# EAGLE board AM_BE200_x32_Rev1 (EAGLE 6.5.0), part 1 of 3
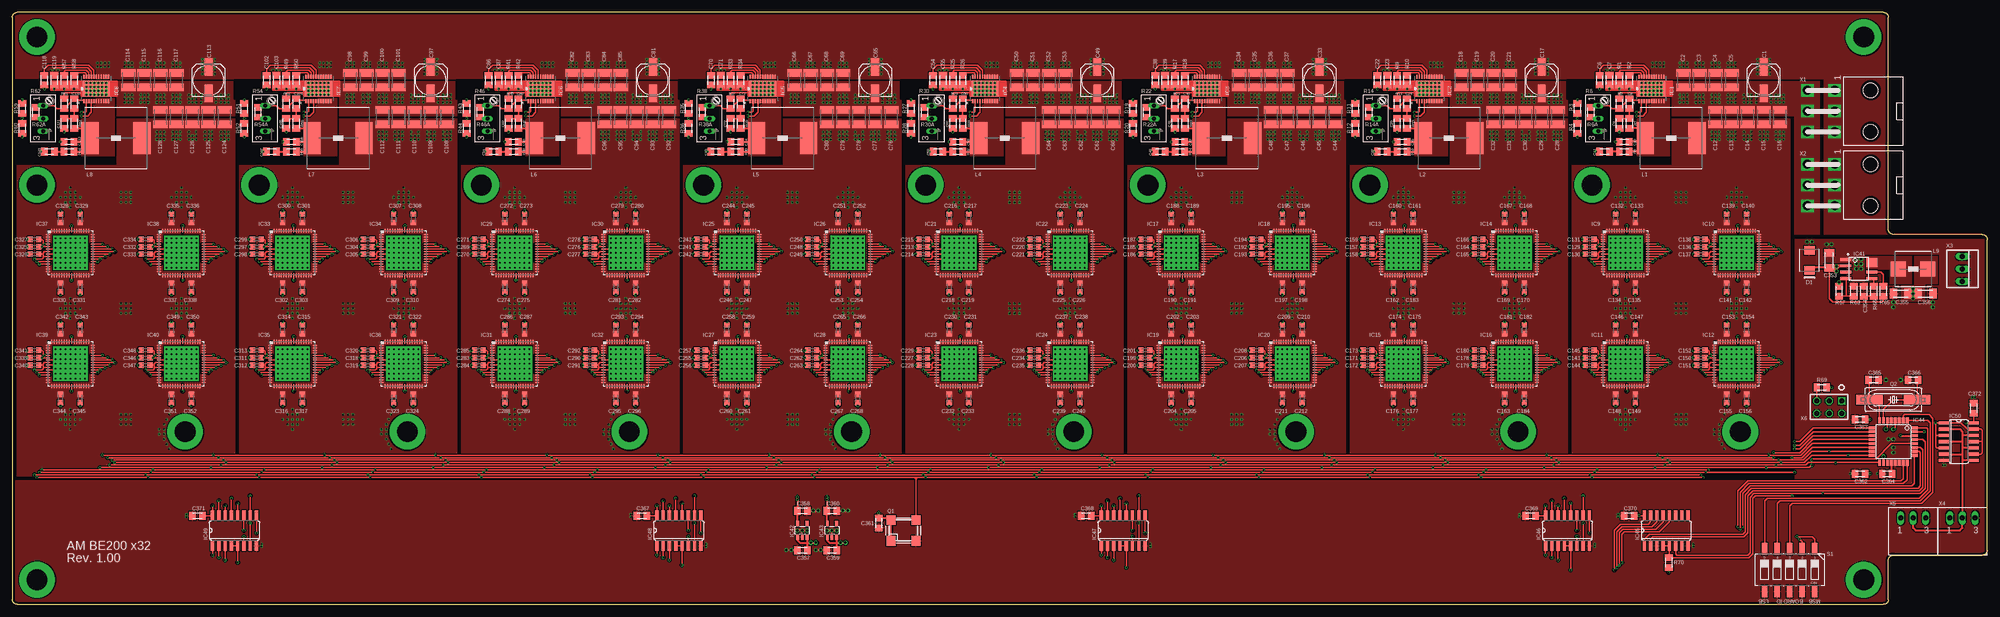
[diagram p9: board, top side]
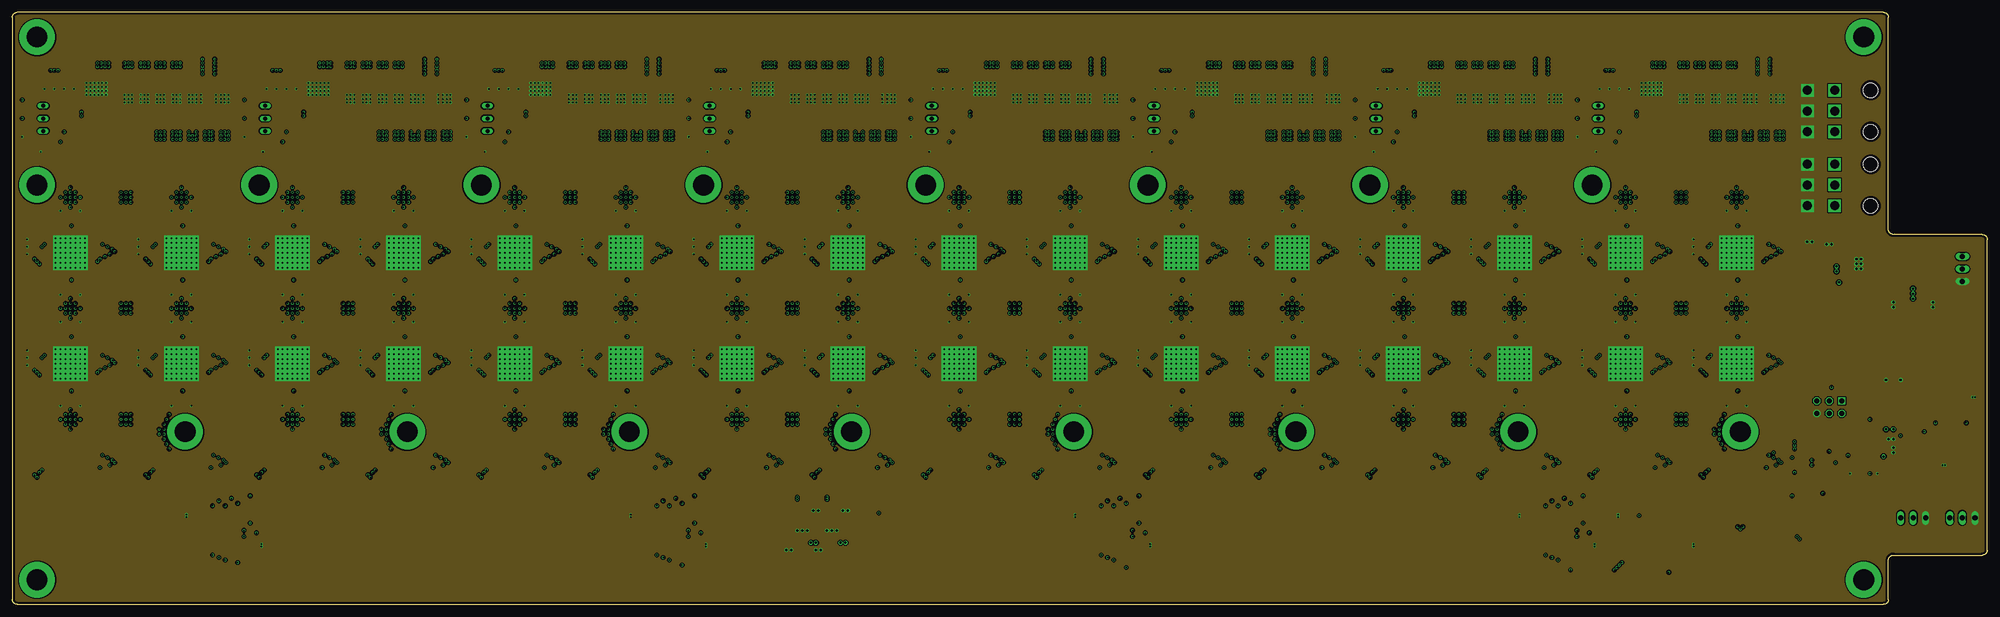
[diagram p10: board, inner layer Route2]
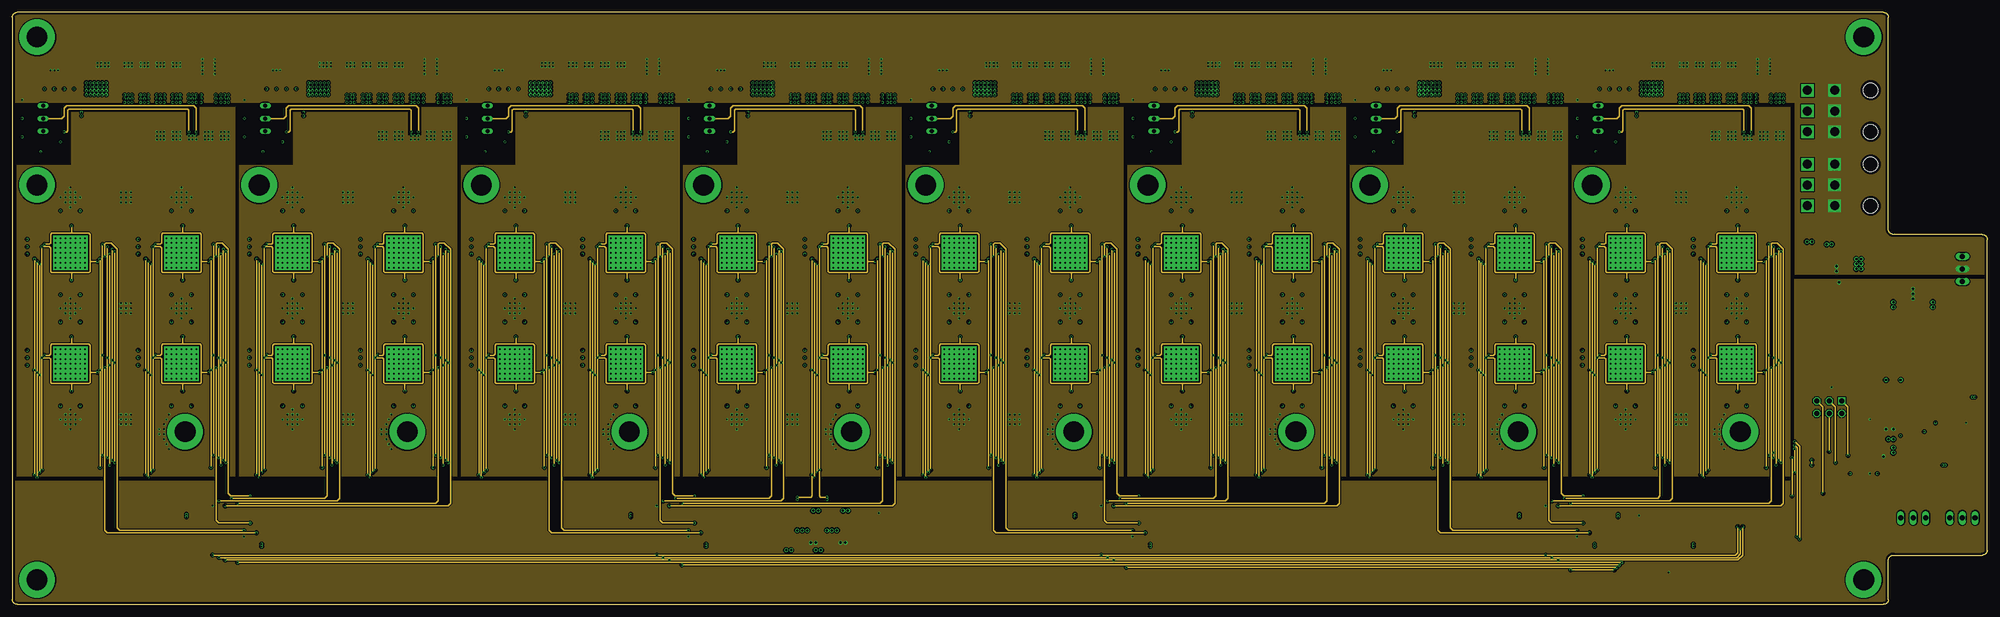
[diagram p11: board, inner layer Route15]
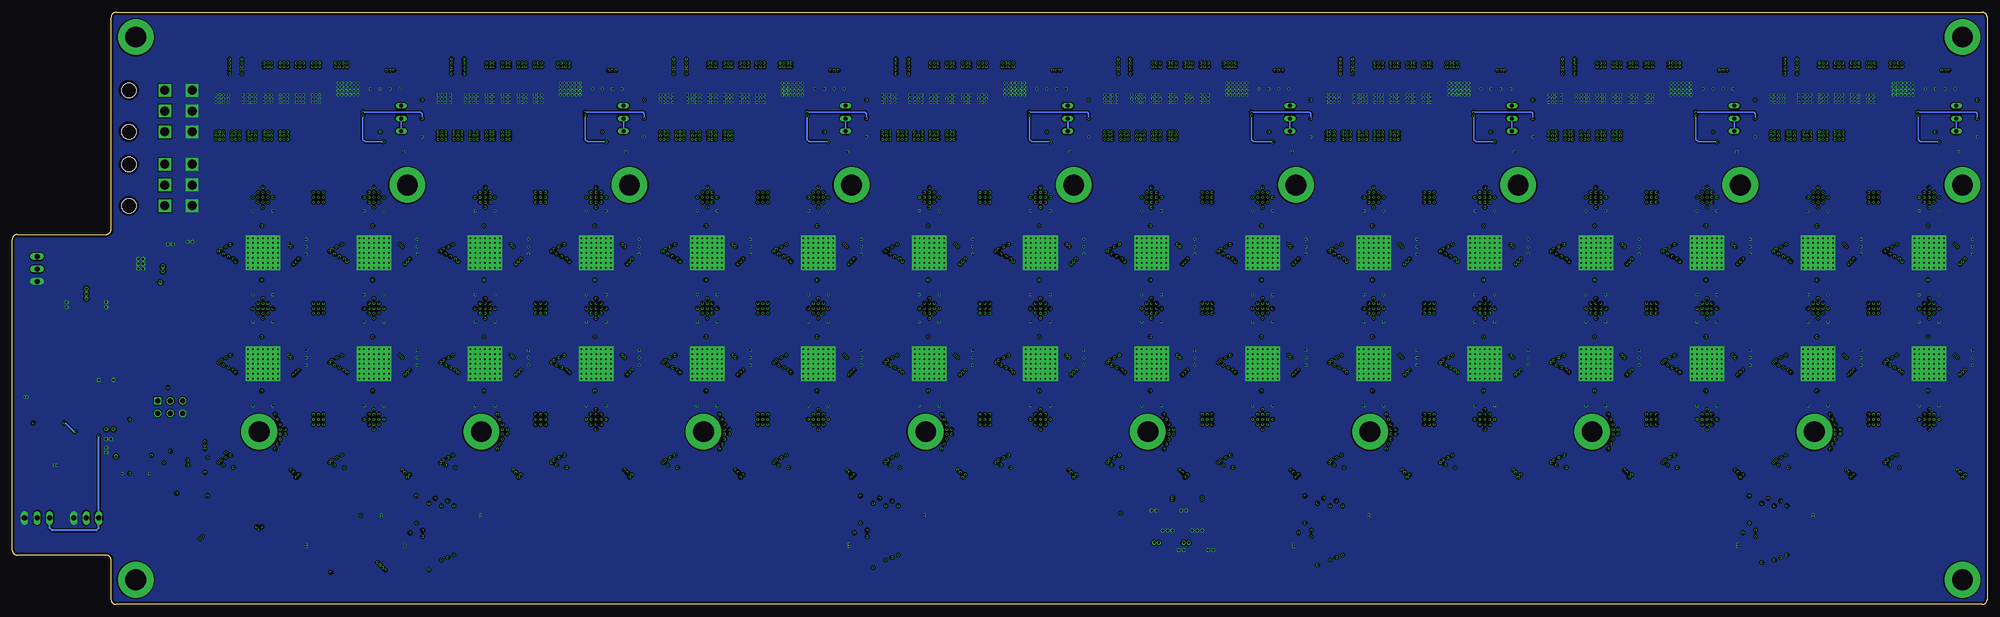
[diagram p12: board, bottom side, seen from below]

Size 400 x 120 mm. Coordinates in mm from the lower left corner, seen from the top.
Outline: 0,119 0,1 arc90 1,0 379,0 arc90 380,1 380,9 arc-90 381,10 399,10 arc90 400,11 400,74 arc90 399,75 381,75 arc-90 380,76 380,119 arc90 379,120 1,120 arc90 0,119
Copper layers (1*2*15*16): Top 0.035mm / dielectric 0.5mm / Route2 0.035mm / dielectric 0.5mm / Route15 0.035mm / dielectric 0.5mm / Bottom 0.035mm
Design rules "default *": minimum track width 8mil, minimum drill 0.3mm, track to track 5mil, track to pad 5mil, pad to pad 5mil, via to via 5mil, smd to smd 4mil, copper to edge 20mil, drill to drill 8mil, minimum pad ring 5mil, minimum via ring 0mil, stop-mask expansion 4mil, vias tented up to drill 30mil, thermal gap 10mil
tRestrict: area 368.2,61.2 to 371.2,68.2; area 0,102.5 to 13.8,106.2; area 45,102.5 to 58.8,106.2; area 90,102.5 to 103.8,106.2; area 135,102.5 to 148.8,106.2; area 180,102.5 to 193.8,106.2; area 225,102.5 to 238.8,106.2; area 270,102.5 to 283.8,106.2; area 315,102.5 to 328.8,106.2

## Footprints (pad centres in the part's own frame; a part is rotated, then mirrored left to right if it is on the bottom)
153CLV-0605 = smd 3.5 x 1.6: + 2.7,0; - -2.7,0
C1210K = smd 1.5 x 2.9: 1 -1.5,0; 2 1.5,0
C0805K = smd 1.3 x 1.6: 1 -1,0; 2 1,0
MYRCL_C0603K = smd 1.05 x 1.08: 1 -0.875,0; 2 0.875,0
C1206K = smd 1.5 x 2: 1 -1.5,0; 2 1.5,0
SMBJ = smd 1.78 x 2.16: A 2.04,0; C -2.03,0
DQP22_5P479X3P24 = smd 0.85 x 0.28: 1 -2.475,2.5; 2 -2.475,2; 3 -2.475,1.5; 4 -2.475,1; 5 -2.475,0.5; 6 -2.475,0; 7 -2.475,-0.5; 8 -2.475,-1; 9 -2.475,-1.5; 10 -2.475,-2; 11 -2.475,-2.5; 12 2.475,-2.5; 13 2.475,-2; 14 2.475,-1.5; 15 2.475,-1; 16 2.475,-0.5; 17 2.475,0; 18 2.475,0.5; 19 2.475,1; 20 2.475,1.5; 21 2.475,2; 22 2.475,2.5 | smd 3.24 x 5.48: 23 0,0 | drill 0.3: GND@1 -1.2,2; GND@2 -0.4,2; GND@3 0.4,2; GND@4 1.2,2; GND@5 -1.2,1.2; GND@6 -0.4,1.2; GND@7 0.4,1.2; GND@8 1.2,1.2; GND@9 -1.2,0.406; GND@10 -0.4,0.4; GND@11 0.4,0.4; GND@12 1.2,0.406; GND@13 -1.2,-0.406; GND@14 -0.4,-0.4; GND@15 0.4,-0.4; GND@16 1.2,-0.406; GND@17 -1.2,-1.2; GND@18 -0.4,-1.2; GND@19 0.4,-1.2; GND@20 1.2,-1.2; GND@21 -1.2,-2; GND@22 -0.4,-2; GND@23 0.4,-2; GND@24 1.2,-2
QFN64-9X9 = smd 0.95 x 0.28: 1 -4.525,3.75; 2 -4.525,3.25; 3 -4.525,2.75; 4 -4.525,2.25; 5 -4.525,1.75; 6 -4.525,1.25; 7 -4.525,0.75; 8 -4.525,0.25; 9 -4.525,-0.25; 10 -4.525,-0.75; 11 -4.525,-1.25; 12 -4.525,-1.75; 13 -4.525,-2.25; 14 -4.525,-2.75; 15 -4.525,-3.25; 16 -4.525,-3.75; 33 4.525,-3.75; 34 4.525,-3.25; 35 4.525,-2.75; 36 4.525,-2.25; 37 4.525,-1.75; 38 4.525,-1.25; 39 4.525,-0.75; 40 4.525,-0.25; 41 4.525,0.25; 42 4.525,0.75; 43 4.525,1.25; 44 4.525,1.75; 45 4.525,2.25; 46 4.525,2.75; 47 4.525,3.25; 48 4.525,3.75 | smd 0.28 x 0.95: 17 -3.75,-4.525; 18 -3.25,-4.525; 19 -2.75,-4.525; 20 -2.25,-4.525; 21 -1.75,-4.525; 22 -1.25,-4.525; 23 -0.75,-4.525; 24 -0.25,-4.525; 25 0.25,-4.525; 26 0.75,-4.525; 27 1.25,-4.525; 28 1.75,-4.525; 29 2.25,-4.525; 30 2.75,-4.525; 31 3.25,-4.525; 32 3.75,-4.525; 49 3.75,4.525; 50 3.25,4.525; 51 2.75,4.525; 52 2.25,4.525; 53 1.75,4.525; 54 1.25,4.525; 55 0.75,4.525; 56 0.25,4.525; 57 -0.25,4.525; 58 -0.75,4.525; 59 -1.25,4.525; 60 -1.75,4.525; 61 -2.25,4.525; 62 -2.75,4.525; 63 -3.25,4.525; 64 -3.75,4.525 | drill 0.3 pad 1 square: EXP@1 -3,3; EXP@2 -2,3; EXP@3 -1,3; EXP@4 0,3; EXP@5 1,3; EXP@6 2,3; EXP@7 3,3; EXP@8 -3,2; EXP@9 -2,2; EXP@10 -1,2; EXP@11 0,2; EXP@12 1,2; EXP@13 2,2; EXP@14 3,2; EXP@15 -3,1; EXP@16 -2,1; EXP@17 -1,1; EXP@18 0,1; EXP@19 1,1; EXP@20 2,1; EXP@21 3,1; EXP@22 -3,0; EXP@23 -2,0; EXP@24 -1,0; EXP@25 0,0; EXP@26 1,0; EXP@27 2,0; EXP@28 3,0; EXP@29 -3,-1; EXP@30 -2,-1; EXP@31 -1,-1; EXP@32 0,-1; EXP@33 1,-1; EXP@34 2,-1; EXP@35 3,-1; EXP@36 -3,-2; EXP@37 -2,-2; EXP@38 -1,-2; EXP@39 0,-2; EXP@40 1,-2; EXP@41 2,-2; EXP@42 3,-2; EXP@43 -3,-3; EXP@44 -2,-3; EXP@45 -1,-3; EXP@46 0,-3; EXP@47 1,-3; EXP@48 2,-3; EXP@49 3,-3
AOZ1021 = smd 0.6 x 2.2: AGND 0.635,-2.6; COMP 1.905,2.6; EN 0.635,2.6; FB 1.905,-2.6; PGND -1.905,-2.6; VIN -0.635,-2.6 | smd 1.87 x 2.2: LX -1.27,2.6
SOT-23-5 = smd 0.55 x 1.2: 1 -0.95,-1.3; 2 0,-1.3; 3 0.95,-1.3; 4 0.95,1.3; 5 -0.95,1.3
TQFP32-08 = smd 1.27 x 0.559: 1 -4.293,2.8; 2 -4.293,2; 3 -4.293,1.2; 4 -4.293,0.4; 5 -4.293,-0.4; 6 -4.293,-1.2; 7 -4.293,-2; 8 -4.293,-2.8; 17 4.293,-2.8; 18 4.293,-2; 19 4.293,-1.2; 20 4.293,-0.4; 21 4.293,0.4; 22 4.293,1.2; 23 4.293,2; 24 4.293,2.8 | smd 0.559 x 1.27: 9 -2.8,-4.293; 10 -2,-4.293; 11 -1.2,-4.293; 12 -0.4,-4.293; 13 0.4,-4.293; 14 1.2,-4.293; 15 2,-4.293; 16 2.8,-4.293; 25 2.8,4.293; 26 2,4.293; 27 1.2,4.293; 28 0.4,4.293; 29 -0.4,4.293; 30 -1.2,4.293; 31 -2,4.293; 32 -2.8,4.293
SO16 = smd 0.66 x 2.032: 1 -4.445,-3.073; 2 -3.175,-3.073; 3 -1.905,-3.073; 4 -0.635,-3.073; 5 0.635,-3.073; 6 1.905,-3.073; 7 3.175,-3.073; 8 4.445,-3.073; 9 4.445,3.073; 10 3.175,3.073; 11 1.905,3.073; 12 0.635,3.073; 13 -0.635,3.073; 14 -1.905,3.073; 15 -3.175,3.073; 16 -4.445,3.073
SO14 = smd 0.66 x 2.032: 1 -3.81,-3.073; 2 -2.54,-3.073; 3 -1.27,-3.073; 4 0,-3.073; 5 1.27,-3.073; 6 2.54,-3.073; 7 3.81,-3.073; 8 3.81,3.073; 9 2.54,3.073; 10 1.27,3.073; 11 0,3.073; 12 -1.27,3.073; 13 -2.54,3.073; 14 -3.81,3.073
INDUCTOR_PA0513 = smd 3.5 x 6.5: 1 -5.25,0; 2 5.25,0
INDCUCTOR_7.3X7.3 = smd 3 x 3: 1 -3,0; 2 3,0
OSCILLATOR_7X5_SMD = smd 1.8 x 2: 1 -2.54,-2.1; 2 2.54,-2.1; 3 2.54,2.1; 4 -2.54,2.1
HC49UP = smd 5.334 x 1.93: 1 -4.826,0; 2 4.826,0
R0805K = smd 1.3 x 1.6: 1 -1,0; 2 1,0
S64W = drill 0.813 long: A 2.54,1.27; E -2.54,1.27; S 0,1.27
CTS-219-05 = smd 1.13 x 2.44: 1 -5.08,-4.3; 2 -2.54,-4.3; 3 0,-4.3; 4 2.54,-4.3; 5 5.08,-4.3; 6 5.08,4.3; 7 2.54,4.3; 8 0,4.3; 9 -2.54,4.3; 10 -5.08,4.3
PCIE6_4.2 = drill 1.8 square: P1 4.2,-2.1; P2 0,-2.1; P3 -4.2,-2.1; P4 4.2,3.4; P5 0,3.4; P6 -4.2,3.4 | hole 3: -4.2,-9.4; 4.2,-9.4
22-23-2031 = drill 1 long: 1 -2.54,0; 2 0,0; 3 2.54,0
XH2.54-3P = drill 1.016 long: 1 -2.54,2.54; 2 0,2.54; 3 2.54,2.54
AVR-ISP-6 = drill 1.016 square: 1 -2.54,-1.27 | drill 1.016 octagon: 2 -2.54,1.27; 3 0,-1.27; 4 0,1.27; 5 2.54,-1.27; 6 2.54,1.27

## Placement (x,y rotation side)
C1  100uF  [153CLV-0605]  354.75,106.25 90 top
C2  22uF  [C1210K]  338.5,106.25 270 top
C3  22uF  [C1210K]  341.75,106.25 270 top
C4  22uF  [C1210K]  345,106.25 270 top
C5  22uF  [C1210K]  348.25,106.25 270 top
C6  4.7uF  [C0805K]  321.5,106.25 270 top
C7  4.7uF  [C0805K]  323.5,106.25 270 top
C8  1nF  [C0805K]  327.5,101.5 90 top
C9  22nF  [C0805K]  325.5,97.5 90 top
C10  100nF  [C0805K]  326.5,93.75 0 top
C11  2,2nF  [C0805K]  322.5,91.75 180 top
C12  100uF  [C1210K]  345,98.75 90 top
C13  100uF  [C1210K]  348.25,98.75 90 top
C14  100uF  [C1210K]  351.5,98.75 90 top
C15  100uF  [C1210K]  354.75,98.75 90 top
C16  100uF  [C1210K]  358,98.75 90 top
C17  100uF  [153CLV-0605]  309.75,106.25 90 top
C18  22uF  [C1210K]  293.5,106.25 270 top
C19  22uF  [C1210K]  296.75,106.25 270 top
C20  22uF  [C1210K]  300,106.25 270 top
C21  22uF  [C1210K]  303.25,106.25 270 top
C22  4.7uF  [C0805K]  276.5,106.25 270 top
C23  4.7uF  [C0805K]  278.5,106.25 270 top
C24  1nF  [C0805K]  282.5,101.5 90 top
C25  22nF  [C0805K]  280.5,97.5 90 top
C26  100nF  [C0805K]  281.5,93.75 0 top
C27  2,2nF  [C0805K]  277.5,91.75 180 top
C28  100uF  [C1210K]  313,98.75 90 top
C29  100uF  [C1210K]  309.75,98.75 90 top
C30  100uF  [C1210K]  306.5,98.75 90 top
C31  100uF  [C1210K]  303.25,98.75 90 top
C32  100uF  [C1210K]  300,98.75 90 top
C33  100uF  [153CLV-0605]  264.75,106.25 90 top
C34  22uF  [C1210K]  248.5,106.25 270 top
C35  22uF  [C1210K]  251.75,106.25 270 top
C36  22uF  [C1210K]  255,106.25 270 top
C37  22uF  [C1210K]  258.25,106.25 270 top
C38  4.7uF  [C0805K]  231.5,106.25 270 top
C39  4.7uF  [C0805K]  233.5,106.25 270 top
C40  1nF  [C0805K]  237.5,101.5 90 top
C41  22nF  [C0805K]  235.5,97.5 90 top
C42  100nF  [C0805K]  236.5,93.75 0 top
C43  2,2nF  [C0805K]  232.5,91.75 180 top
C44  100uF  [C1210K]  268,98.75 90 top
C45  100uF  [C1210K]  264.75,98.75 90 top
C46  100uF  [C1210K]  261.5,98.75 90 top
C47  100uF  [C1210K]  258.25,98.75 90 top
C48  100uF  [C1210K]  255,98.75 90 top
C49  100uF  [153CLV-0605]  219.75,106.25 90 top
C50  22uF  [C1210K]  203.5,106.25 270 top
C51  22uF  [C1210K]  206.75,106.25 270 top
C52  22uF  [C1210K]  210,106.25 270 top
C53  22uF  [C1210K]  213.25,106.25 270 top
C54  4.7uF  [C0805K]  186.5,106.25 270 top
C55  4.7uF  [C0805K]  188.5,106.25 270 top
C56  1nF  [C0805K]  192.5,101.5 90 top
C57  22nF  [C0805K]  190.5,97.5 90 top
C58  100nF  [C0805K]  191.5,93.75 0 top
C59  2,2nF  [C0805K]  187.5,91.75 180 top
C60  100uF  [C1210K]  223,98.75 90 top
C61  100uF  [C1210K]  219.75,98.75 90 top
C62  100uF  [C1210K]  216.5,98.75 90 top
C63  100uF  [C1210K]  213.25,98.75 90 top
C64  100uF  [C1210K]  210,98.75 90 top
C65  100uF  [153CLV-0605]  174.75,106.25 90 top
C66  22uF  [C1210K]  158.5,106.25 270 top
C67  22uF  [C1210K]  161.75,106.25 270 top
C68  22uF  [C1210K]  165,106.25 270 top
C69  22uF  [C1210K]  168.25,106.25 270 top
C70  4.7uF  [C0805K]  141.5,106.25 270 top
C71  4.7uF  [C0805K]  143.5,106.25 270 top
C72  1nF  [C0805K]  147.5,101.5 90 top
C73  22nF  [C0805K]  145.5,97.5 90 top
C74  100nF  [C0805K]  146.5,93.75 0 top
C75  2,2nF  [C0805K]  142.5,91.75 180 top
C76  100uF  [C1210K]  178,98.75 90 top
C77  100uF  [C1210K]  174.75,98.75 90 top
C78  100uF  [C1210K]  171.5,98.75 90 top
C79  100uF  [C1210K]  168.25,98.75 90 top
C80  100uF  [C1210K]  165,98.75 90 top
C81  100uF  [153CLV-0605]  129.75,106.25 90 top
C82  22uF  [C1210K]  113.5,106.25 270 top
C83  22uF  [C1210K]  116.75,106.25 270 top
C84  22uF  [C1210K]  120,106.25 270 top
C85  22uF  [C1210K]  123.25,106.25 270 top
C86  4.7uF  [C0805K]  96.5,106.25 270 top
C87  4.7uF  [C0805K]  98.5,106.25 270 top
C88  1nF  [C0805K]  102.5,101.5 90 top
C89  22nF  [C0805K]  100.5,97.5 90 top
C90  100nF  [C0805K]  101.5,93.75 0 top
C91  2,2nF  [C0805K]  97.5,91.75 180 top
C92  100uF  [C1210K]  133,98.75 90 top
C93  100uF  [C1210K]  129.75,98.75 90 top
C94  100uF  [C1210K]  126.5,98.75 90 top
C95  100uF  [C1210K]  123.25,98.75 90 top
C96  100uF  [C1210K]  120,98.75 90 top
C97  100uF  [153CLV-0605]  84.75,106.25 90 top
C98  22uF  [C1210K]  68.5,106.25 270 top
C99  22uF  [C1210K]  71.75,106.25 270 top
C100  22uF  [C1210K]  75,106.25 270 top
C101  22uF  [C1210K]  78.25,106.25 270 top
C102  4.7uF  [C0805K]  51.5,106.25 270 top
C103  4.7uF  [C0805K]  53.5,106.25 270 top
C104  1nF  [C0805K]  57.5,101.5 90 top
C105  22nF  [C0805K]  55.5,97.5 90 top
C106  100nF  [C0805K]  56.5,93.75 0 top
C107  2,2nF  [C0805K]  52.5,91.75 180 top
C108  100uF  [C1210K]  88,98.75 90 top
C109  100uF  [C1210K]  84.75,98.75 90 top
C110  100uF  [C1210K]  81.5,98.75 90 top
C111  100uF  [C1210K]  78.25,98.75 90 top
C112  100uF  [C1210K]  75,98.75 90 top
C113  100uF  [153CLV-0605]  39.75,106.25 90 top
C114  22uF  [C1210K]  23.5,106.25 270 top
C115  22uF  [C1210K]  26.75,106.25 270 top
C116  22uF  [C1210K]  30,106.25 270 top
C117  22uF  [C1210K]  33.25,106.25 270 top
C118  4.7uF  [C0805K]  6.5,106.25 270 top
C119  4.7uF  [C0805K]  8.5,106.25 270 top
C120  1nF  [C0805K]  12.5,101.5 90 top
C121  22nF  [C0805K]  10.5,97.5 90 top
C122  100nF  [C0805K]  11.5,93.75 0 top
C123  2,2nF  [C0805K]  7.5,91.75 180 top
C124  100uF  [C1210K]  43,98.75 90 top
C125  100uF  [C1210K]  39.75,98.75 90 top
C126  100uF  [C1210K]  36.5,98.75 90 top
C127  100uF  [C1210K]  33.25,98.75 90 top
C128  100uF  [C1210K]  30,98.75 90 top
C129  100nF  [MYRCL_C0603K]  319.5,72.5 0 top
C130  100nF  [MYRCL_C0603K]  319.5,71 180 top
C131  100nF  [MYRCL_C0603K]  319.5,74 180 top
C132  100nF  [MYRCL_C0603K]  324.75,78.25 90 top
C133  4.7uF  [MYRCL_C0603K]  328.75,78.25 90 top
C134  100nF  [MYRCL_C0603K]  324.75,64.25 270 top
C135  4.7uF  [MYRCL_C0603K]  328.75,64.25 270 top
C136  100nF  [MYRCL_C0603K]  342,72.5 0 top
C137  100nF  [MYRCL_C0603K]  342,71 180 top
C138  100nF  [MYRCL_C0603K]  342,74 180 top
C139  100nF  [MYRCL_C0603K]  347.25,78.25 90 top
C140  4.7uF  [MYRCL_C0603K]  351.25,78.25 90 top
C141  100nF  [MYRCL_C0603K]  347.25,64.25 270 top
C142  4.7uF  [MYRCL_C0603K]  351.25,64.25 270 top
C143  100nF  [MYRCL_C0603K]  319.5,50 0 top
C144  100nF  [MYRCL_C0603K]  319.5,48.5 180 top
C145  100nF  [MYRCL_C0603K]  319.5,51.5 180 top
C146  100nF  [MYRCL_C0603K]  324.75,55.75 90 top
C147  4.7uF  [MYRCL_C0603K]  328.75,55.75 90 top
C148  100nF  [MYRCL_C0603K]  324.75,41.75 270 top
C149  4.7uF  [MYRCL_C0603K]  328.75,41.75 270 top
C150  100nF  [MYRCL_C0603K]  342,50 0 top
C151  100nF  [MYRCL_C0603K]  342,48.5 180 top
C152  100nF  [MYRCL_C0603K]  342,51.5 180 top
C153  100nF  [MYRCL_C0603K]  347.25,55.75 90 top
C154  4.7uF  [MYRCL_C0603K]  351.25,55.75 90 top
C155  100nF  [MYRCL_C0603K]  347.25,41.75 270 top
C156  4.7uF  [MYRCL_C0603K]  351.25,41.75 270 top
C157  100nF  [MYRCL_C0603K]  274.5,72.5 0 top
C158  100nF  [MYRCL_C0603K]  274.5,71 180 top
C159  100nF  [MYRCL_C0603K]  274.5,74 180 top
C160  100nF  [MYRCL_C0603K]  279.75,78.25 90 top
C161  4.7uF  [MYRCL_C0603K]  283.75,78.25 90 top
C162  100nF  [MYRCL_C0603K]  279.75,64.25 270 top
C163  4.7uF  [MYRCL_C0603K]  302.25,41.75 270 top
C164  100nF  [MYRCL_C0603K]  297,72.5 0 top
C165  100nF  [MYRCL_C0603K]  297,71 180 top
C166  100nF  [MYRCL_C0603K]  297,74 180 top
C167  100nF  [MYRCL_C0603K]  302.25,78.25 90 top
C168  4.7uF  [MYRCL_C0603K]  306.25,78.25 90 top
C169  100nF  [MYRCL_C0603K]  302.25,64.25 270 top
C170  4.7uF  [MYRCL_C0603K]  306.25,64.25 270 top
C171  100nF  [MYRCL_C0603K]  274.5,50 0 top
C172  100nF  [MYRCL_C0603K]  274.5,48.5 180 top
C173  100nF  [MYRCL_C0603K]  274.5,51.5 180 top
C174  100nF  [MYRCL_C0603K]  279.75,55.75 90 top
C175  4.7uF  [MYRCL_C0603K]  283.75,55.75 90 top
C176  100nF  [MYRCL_C0603K]  279.75,41.75 270 top
C177  4.7uF  [MYRCL_C0603K]  283.75,41.75 270 top
C178  100nF  [MYRCL_C0603K]  297,50 0 top
C179  100nF  [MYRCL_C0603K]  297,48.5 180 top
C180  100nF  [MYRCL_C0603K]  297,51.5 180 top
C181  100nF  [MYRCL_C0603K]  302.25,55.75 90 top
C182  4.7uF  [MYRCL_C0603K]  306.25,55.75 90 top
C183  100nF  [MYRCL_C0603K]  283.75,64.25 270 top
C184  4.7uF  [MYRCL_C0603K]  306.25,41.75 270 top
C185  100nF  [MYRCL_C0603K]  229.5,72.5 0 top
C186  100nF  [MYRCL_C0603K]  229.5,71 180 top
C187  100nF  [MYRCL_C0603K]  229.5,74 180 top
C188  100nF  [MYRCL_C0603K]  234.75,78.25 90 top
C189  4.7uF  [MYRCL_C0603K]  238.75,78.25 90 top
C190  100nF  [MYRCL_C0603K]  234.75,64.25 270 top
C191  4.7uF  [MYRCL_C0603K]  238.75,64.25 270 top
C192  100nF  [MYRCL_C0603K]  252,72.5 0 top
C193  100nF  [MYRCL_C0603K]  252,71 180 top
C194  100nF  [MYRCL_C0603K]  252,74 180 top
C195  100nF  [MYRCL_C0603K]  257.25,78.25 90 top
C196  4.7uF  [MYRCL_C0603K]  261.25,78.25 90 top
C197  100nF  [MYRCL_C0603K]  257.25,64.25 270 top
C198  4.7uF  [MYRCL_C0603K]  261.25,64.25 270 top
C199  100nF  [MYRCL_C0603K]  229.5,50 0 top
C200  100nF  [MYRCL_C0603K]  229.5,48.5 180 top
C201  100nF  [MYRCL_C0603K]  229.5,51.5 180 top
C202  100nF  [MYRCL_C0603K]  234.75,55.75 90 top
C203  4.7uF  [MYRCL_C0603K]  238.75,55.75 90 top
C204  100nF  [MYRCL_C0603K]  234.75,41.75 270 top
C205  4.7uF  [MYRCL_C0603K]  238.75,41.75 270 top
C206  100nF  [MYRCL_C0603K]  252,50 0 top
C207  100nF  [MYRCL_C0603K]  252,48.5 180 top
C208  100nF  [MYRCL_C0603K]  252,51.5 180 top
C209  100nF  [MYRCL_C0603K]  257.25,55.75 90 top
C210  4.7uF  [MYRCL_C0603K]  261.25,55.75 90 top
C211  100nF  [MYRCL_C0603K]  257.25,41.75 270 top
C212  4.7uF  [MYRCL_C0603K]  261.25,41.75 270 top
C213  100nF  [MYRCL_C0603K]  184.5,72.5 0 top
C214  100nF  [MYRCL_C0603K]  184.5,71 180 top
C215  100nF  [MYRCL_C0603K]  184.5,74 180 top
C216  100nF  [MYRCL_C0603K]  189.75,78.25 90 top
C217  4.7uF  [MYRCL_C0603K]  193.75,78.25 90 top
C218  100nF  [MYRCL_C0603K]  189.75,64.25 270 top
C219  4.7uF  [MYRCL_C0603K]  193.75,64.25 270 top
C220  100nF  [MYRCL_C0603K]  207,72.5 0 top
C221  100nF  [MYRCL_C0603K]  207,71 180 top
C222  100nF  [MYRCL_C0603K]  207,74 180 top
C223  100nF  [MYRCL_C0603K]  212.25,78.25 90 top
C224  4.7uF  [MYRCL_C0603K]  216.25,78.25 90 top
C225  100nF  [MYRCL_C0603K]  212.25,64.25 270 top
C226  4.7uF  [MYRCL_C0603K]  216.25,64.25 270 top
C227  100nF  [MYRCL_C0603K]  184.5,50 0 top
C228  100nF  [MYRCL_C0603K]  184.5,48.5 180 top
C229  100nF  [MYRCL_C0603K]  184.5,51.5 180 top
C230  100nF  [MYRCL_C0603K]  189.75,55.75 90 top
C231  4.7uF  [MYRCL_C0603K]  193.75,55.75 90 top
C232  100nF  [MYRCL_C0603K]  189.75,41.75 270 top
C233  4.7uF  [MYRCL_C0603K]  193.75,41.75 270 top
C234  100nF  [MYRCL_C0603K]  207,50 0 top
C235  100nF  [MYRCL_C0603K]  207,48.5 180 top
C236  100nF  [MYRCL_C0603K]  207,51.5 180 top
C237  100nF  [MYRCL_C0603K]  212.25,55.75 90 top
C238  4.7uF  [MYRCL_C0603K]  216.25,55.75 90 top
C239  100nF  [MYRCL_C0603K]  212.25,41.75 270 top
C240  4.7uF  [MYRCL_C0603K]  216.25,41.75 270 top
C241  100nF  [MYRCL_C0603K]  139.5,72.5 0 top
C242  100nF  [MYRCL_C0603K]  139.5,71 180 top
C243  100nF  [MYRCL_C0603K]  139.5,74 180 top
C244  100nF  [MYRCL_C0603K]  144.75,78.25 90 top
C245  4.7uF  [MYRCL_C0603K]  148.75,78.25 90 top
C246  100nF  [MYRCL_C0603K]  144.75,64.25 270 top
C247  4.7uF  [MYRCL_C0603K]  148.75,64.25 270 top
C248  100nF  [MYRCL_C0603K]  162,72.5 0 top
C249  100nF  [MYRCL_C0603K]  162,71 180 top
C250  100nF  [MYRCL_C0603K]  162,74 180 top
C251  100nF  [MYRCL_C0603K]  167.25,78.25 90 top
C252  4.7uF  [MYRCL_C0603K]  171.25,78.25 90 top
C253  100nF  [MYRCL_C0603K]  167.25,64.25 270 top
C254  4.7uF  [MYRCL_C0603K]  171.25,64.25 270 top
C255  100nF  [MYRCL_C0603K]  139.5,50 0 top
C256  100nF  [MYRCL_C0603K]  139.5,48.5 180 top
C257  100nF  [MYRCL_C0603K]  139.5,51.5 180 top
C258  100nF  [MYRCL_C0603K]  144.75,55.75 90 top
C259  4.7uF  [MYRCL_C0603K]  148.75,55.75 90 top
C260  100nF  [MYRCL_C0603K]  144.75,41.75 270 top
C261  4.7uF  [MYRCL_C0603K]  148.75,41.75 270 top
C262  100nF  [MYRCL_C0603K]  162,50 0 top
C263  100nF  [MYRCL_C0603K]  162,48.5 180 top
C264  100nF  [MYRCL_C0603K]  162,51.5 180 top
C265  100nF  [MYRCL_C0603K]  167.25,55.75 90 top
C266  4.7uF  [MYRCL_C0603K]  171.25,55.75 90 top
C267  100nF  [MYRCL_C0603K]  167.25,41.75 270 top
C268  4.7uF  [MYRCL_C0603K]  171.25,41.75 270 top
C269  100nF  [MYRCL_C0603K]  94.5,72.5 0 top
C270  100nF  [MYRCL_C0603K]  94.5,71 180 top
C271  100nF  [MYRCL_C0603K]  94.5,74 180 top
C272  100nF  [MYRCL_C0603K]  99.75,78.25 90 top
C273  4.7uF  [MYRCL_C0603K]  103.75,78.25 90 top
C274  100nF  [MYRCL_C0603K]  99.75,64.25 270 top
C275  4.7uF  [MYRCL_C0603K]  103.75,64.25 270 top
C276  100nF  [MYRCL_C0603K]  117,72.5 0 top
C277  100nF  [MYRCL_C0603K]  117,71 180 top
C278  100nF  [MYRCL_C0603K]  117,74 180 top
C279  100nF  [MYRCL_C0603K]  122.25,78.25 90 top
C280  4.7uF  [MYRCL_C0603K]  126.25,78.25 90 top
C281  100nF  [MYRCL_C0603K]  122.25,64.25 270 top
C282  4.7uF  [MYRCL_C0603K]  126.25,64.25 270 top
C283  100nF  [MYRCL_C0603K]  94.5,50 0 top
C284  100nF  [MYRCL_C0603K]  94.5,48.5 180 top
C285  100nF  [MYRCL_C0603K]  94.5,51.5 180 top
C286  100nF  [MYRCL_C0603K]  99.75,55.75 90 top
C287  4.7uF  [MYRCL_C0603K]  103.75,55.75 90 top
C288  100nF  [MYRCL_C0603K]  99.75,41.75 270 top
C289  4.7uF  [MYRCL_C0603K]  103.75,41.75 270 top
C290  100nF  [MYRCL_C0603K]  117,50 0 top
C291  100nF  [MYRCL_C0603K]  117,48.5 180 top
C292  100nF  [MYRCL_C0603K]  117,51.5 180 top
C293  100nF  [MYRCL_C0603K]  122.25,55.75 90 top
C294  4.7uF  [MYRCL_C0603K]  126.25,55.75 90 top
C295  100nF  [MYRCL_C0603K]  122.25,41.75 270 top
C296  4.7uF  [MYRCL_C0603K]  126.25,41.75 270 top
C297  100nF  [MYRCL_C0603K]  49.5,72.5 0 top
C298  100nF  [MYRCL_C0603K]  49.5,71 180 top
C299  100nF  [MYRCL_C0603K]  49.5,74 180 top
C300  100nF  [MYRCL_C0603K]  54.75,78.25 90 top
C301  4.7uF  [MYRCL_C0603K]  58.75,78.25 90 top
C302  100nF  [MYRCL_C0603K]  54.75,64.25 270 top
C303  4.7uF  [MYRCL_C0603K]  58.75,64.25 270 top
C304  100nF  [MYRCL_C0603K]  72,72.5 0 top
C305  100nF  [MYRCL_C0603K]  72,71 180 top
C306  100nF  [MYRCL_C0603K]  72,74 180 top
C307  100nF  [MYRCL_C0603K]  77.25,78.25 90 top
C308  4.7uF  [MYRCL_C0603K]  81.25,78.25 90 top
C309  100nF  [MYRCL_C0603K]  77.25,64.25 270 top
C310  4.7uF  [MYRCL_C0603K]  81.25,64.25 270 top
C311  100nF  [MYRCL_C0603K]  49.5,50 0 top
C312  100nF  [MYRCL_C0603K]  49.5,48.5 180 top
C313  100nF  [MYRCL_C0603K]  49.5,51.5 180 top
C314  100nF  [MYRCL_C0603K]  54.75,55.75 90 top
C315  4.7uF  [MYRCL_C0603K]  58.75,55.75 90 top
C316  100nF  [MYRCL_C0603K]  54.75,41.75 270 top
C317  4.7uF  [MYRCL_C0603K]  58.75,41.75 270 top
C318  100nF  [MYRCL_C0603K]  72,50 0 top
C319  100nF  [MYRCL_C0603K]  72,48.5 180 top
C320  100nF  [MYRCL_C0603K]  72,51.5 180 top
C321  100nF  [MYRCL_C0603K]  77.25,55.75 90 top
C322  4.7uF  [MYRCL_C0603K]  81.25,55.75 90 top
C323  100nF  [MYRCL_C0603K]  77.25,41.75 270 top
C324  4.7uF  [MYRCL_C0603K]  81.25,41.75 270 top
C325  100nF  [MYRCL_C0603K]  4.5,72.5 0 top
C326  100nF  [MYRCL_C0603K]  4.5,71 180 top
C327  100nF  [MYRCL_C0603K]  4.5,74 180 top
C328  100nF  [MYRCL_C0603K]  9.75,78.25 90 top
C329  4.7uF  [MYRCL_C0603K]  13.75,78.25 90 top
C330  100nF  [MYRCL_C0603K]  9.75,64.25 270 top
C331  4.7uF  [MYRCL_C0603K]  13.75,64.25 270 top
C332  100nF  [MYRCL_C0603K]  27,72.5 0 top
C333  100nF  [MYRCL_C0603K]  27,71 180 top
C334  100nF  [MYRCL_C0603K]  27,74 180 top
C335  100nF  [MYRCL_C0603K]  32.25,78.25 90 top
C336  4.7uF  [MYRCL_C0603K]  36.25,78.25 90 top
C337  100nF  [MYRCL_C0603K]  32.25,64.25 270 top
C338  4.7uF  [MYRCL_C0603K]  36.25,64.25 270 top
C339  100nF  [MYRCL_C0603K]  4.5,50 0 top
C340  100nF  [MYRCL_C0603K]  4.5,48.5 180 top
C341  100nF  [MYRCL_C0603K]  4.5,51.5 180 top
C342  100nF  [MYRCL_C0603K]  9.75,55.75 90 top
C343  4.7uF  [MYRCL_C0603K]  13.75,55.75 90 top
C344  100nF  [MYRCL_C0603K]  9.75,41.75 270 top
C345  4.7uF  [MYRCL_C0603K]  13.75,41.75 270 top
C346  100nF  [MYRCL_C0603K]  27,50 0 top
C347  100nF  [MYRCL_C0603K]  27,48.5 180 top
C348  100nF  [MYRCL_C0603K]  27,51.5 180 top
C349  100nF  [MYRCL_C0603K]  32.25,55.75 90 top
C350  4.7uF  [MYRCL_C0603K]  36.25,55.75 90 top
C351  100nF  [MYRCL_C0603K]  32.25,41.75 270 top
C352  4.7uF  [MYRCL_C0603K]  36.25,41.75 270 top
C353  10uF  [C1206K]  368,69.75 90 top
C354  2,2nF  [C0805K]  375,63.5 90 top
C355  22uF  [C1206K]  382.5,63 180 top
C356  22uF  [C1206K]  387.5,63 0 top
C357  4,7uF  [C0805K]  160,11 0 top
C358  4,7uF  [C0805K]  160,19 180 top
C359  4,7uF  [C0805K]  166,11 0 top
C360  4,7uF  [C0805K]  166,19 180 top
C361  100nF  [C0805K]  175.5,16.5 90 top
C362  100nF  [C0805K]  374.25,26.5 0 top
C363  4,7uF  [C0805K]  374.25,37.5 0 top
C364  100nF  [C0805K]  379.75,26.5 0 top
C365  22pF  [C0805K]  377,45.5 0 top
C366  22pF  [C0805K]  385,45.5 180 top
C367  100nF  [C0805K]  127.5,18 0 top
C368  100nF  [C0805K]  217.5,18 0 top
C369  100nF  [C0805K]  307.5,18 0 top
C370  100nF  [C0805K]  327.5,18 0 top
C371  100nF  [C0805K]  37.5,18 0 top
C372  100nF  [C0805K]  397.25,39.75 270 top
D1  MBR_12V  [SMBJ]  364,69.75 90 top
IC1  TPS53353_TPS53355_DQP_22  [DQP22_5P479X3P24]  332,104.5 90 top
IC2  TPS53353_TPS53355_DQP_22  [DQP22_5P479X3P24]  287,104.5 90 top
IC3  TPS53353_TPS53355_DQP_22  [DQP22_5P479X3P24]  242,104.5 90 top
IC4  TPS53353_TPS53355_DQP_22  [DQP22_5P479X3P24]  197,104.5 90 top
IC5  TPS53353_TPS53355_DQP_22  [DQP22_5P479X3P24]  152,104.5 90 top
IC6  TPS53353_TPS53355_DQP_22  [DQP22_5P479X3P24]  107,104.5 90 top
IC7  TPS53353_TPS53355_DQP_22  [DQP22_5P479X3P24]  62,104.5 90 top
IC8  TPS53353_TPS53355_DQP_22  [DQP22_5P479X3P24]  17,104.5 90 top
IC9  BE200_QFN64_9X9  [QFN64-9X9]  326.75,71.25 0 top
IC10  BE200_QFN64_9X9  [QFN64-9X9]  349.25,71.25 0 top
IC11  BE200_QFN64_9X9  [QFN64-9X9]  326.75,48.75 0 top
IC12  BE200_QFN64_9X9  [QFN64-9X9]  349.25,48.75 0 top
IC13  BE200_QFN64_9X9  [QFN64-9X9]  281.75,71.25 0 top
IC14  BE200_QFN64_9X9  [QFN64-9X9]  304.25,71.25 0 top
IC15  BE200_QFN64_9X9  [QFN64-9X9]  281.75,48.75 0 top
IC16  BE200_QFN64_9X9  [QFN64-9X9]  304.25,48.75 0 top
IC17  BE200_QFN64_9X9  [QFN64-9X9]  236.75,71.25 0 top
IC18  BE200_QFN64_9X9  [QFN64-9X9]  259.25,71.25 0 top
IC19  BE200_QFN64_9X9  [QFN64-9X9]  236.75,48.75 0 top
IC20  BE200_QFN64_9X9  [QFN64-9X9]  259.25,48.75 0 top
IC21  BE200_QFN64_9X9  [QFN64-9X9]  191.75,71.25 0 top
IC22  BE200_QFN64_9X9  [QFN64-9X9]  214.25,71.25 0 top
IC23  BE200_QFN64_9X9  [QFN64-9X9]  191.75,48.75 0 top
IC24  BE200_QFN64_9X9  [QFN64-9X9]  214.25,48.75 0 top
IC25  BE200_QFN64_9X9  [QFN64-9X9]  146.75,71.25 0 top
IC26  BE200_QFN64_9X9  [QFN64-9X9]  169.25,71.25 0 top
IC27  BE200_QFN64_9X9  [QFN64-9X9]  146.75,48.75 0 top
IC28  BE200_QFN64_9X9  [QFN64-9X9]  169.25,48.75 0 top
IC29  BE200_QFN64_9X9  [QFN64-9X9]  101.75,71.25 0 top
IC30  BE200_QFN64_9X9  [QFN64-9X9]  124.25,71.25 0 top
IC31  BE200_QFN64_9X9  [QFN64-9X9]  101.75,48.75 0 top
IC32  BE200_QFN64_9X9  [QFN64-9X9]  124.25,48.75 0 top
IC33  BE200_QFN64_9X9  [QFN64-9X9]  56.75,71.25 0 top
IC34  BE200_QFN64_9X9  [QFN64-9X9]  79.25,71.25 0 top
IC35  BE200_QFN64_9X9  [QFN64-9X9]  56.75,48.75 0 top
IC36  BE200_QFN64_9X9  [QFN64-9X9]  79.25,48.75 0 top
IC37  BE200_QFN64_9X9  [QFN64-9X9]  11.75,71.25 0 top
IC38  BE200_QFN64_9X9  [QFN64-9X9]  34.25,71.25 0 top
IC39  BE200_QFN64_9X9  [QFN64-9X9]  11.75,48.75 0 top
IC40  BE200_QFN64_9X9  [QFN64-9X9]  34.25,48.75 0 top
IC41  AOZ1021  [AOZ1021]  374,68 270 top
IC42  TLV71209DBV  [SOT-23-5]  160,15 0 top
IC43  TLV7  [SOT-23-5]  166,15 0 top
IC44  MEGA88-AU  [TQFP32-08]  381,33 270 top
IC45  74HC138D  [SO16]  335,15 0 top
IC46  74HC138D  [SO16]  315,15 0 top
IC47  74HC138D  [SO16]  225,15 0 top
IC48  74HC138D  [SO16]  135,15 0 top
IC49  74HC138D  [SO16]  45,15 0 top
IC50  7407D  [SO14]  394.25,33 270 top
L1  0.47uH  [INDUCTOR_PA0513]  336,94.5 180 top
L2  0.47uH  [INDUCTOR_PA0513]  291,94.5 180 top
L3  0.47uH  [INDUCTOR_PA0513]  246,94.5 180 top
L4  0.47uH  [INDUCTOR_PA0513]  201,94.5 180 top
L5  0.47uH  [INDUCTOR_PA0513]  156,94.5 180 top
L6  0.47uH  [INDUCTOR_PA0513]  111,94.5 180 top
L7  0.47uH  [INDUCTOR_PA0513]  66,94.5 180 top
L8  0.47uH  [INDUCTOR_PA0513]  21,94.5 180 top
L9  4.7uH  [INDCUCTOR_7.3X7.3]  385,68 0 top
Q1  20MHZ  [OSCILLATOR_7X5_SMD]  180.5,15 0 top
Q2  7.37MHZ  [HC49UP]  381,41.5 0 top
R1  39K  [R0805K]  325.5,106.25 90 top
R2  180K  [R0805K]  327.5,106.25 90 top
R3  200K  [R0805K]  317,100.5 90 top
R4  100K  [R0805K]  317,96.5 90 top
R5  10K  [R0805K]  325.5,101.5 270 top
R6  5K  [S64W]  322.5,98.5 90 top
R6A  2K49  [R0805K]  319.75,99.75 270 top
R7  56K  [R0805K]  327.5,97.5 270 top
R8  3 or 3.01  [R0805K]  326.5,91.75 0 top
R9  39K  [R0805K]  280.5,106.25 90 top
R10  180K  [R0805K]  282.5,106.25 90 top
R11  200K  [R0805K]  272,100.5 90 top
R12  100K  [R0805K]  272,96.5 90 top
R13  10K  [R0805K]  280.5,101.5 270 top
R14  5K  [S64W]  277.5,98.5 90 top
R14A  2K49  [R0805K]  274.75,99.75 270 top
R15  56K  [R0805K]  282.5,97.5 270 top
R16  3 or 3.01  [R0805K]  281.5,91.75 0 top
R17  39K  [R0805K]  235.5,106.25 90 top
R18  180K  [R0805K]  237.5,106.25 90 top
R19  200K  [R0805K]  227,100.5 90 top
R20  100K  [R0805K]  227,96.5 90 top
R21  10K  [R0805K]  235.5,101.5 270 top
R22  5K  [S64W]  232.5,98.5 90 top
R22A  2K49  [R0805K]  229.75,99.75 270 top
R23  56K  [R0805K]  237.5,97.5 270 top
R24  3 or 3.01  [R0805K]  236.5,91.75 0 top
R25  39K  [R0805K]  190.5,106.25 90 top
R26  180K  [R0805K]  192.5,106.25 90 top
R27  200K  [R0805K]  182,100.5 90 top
R28  100K  [R0805K]  182,96.5 90 top
R29  10K  [R0805K]  190.5,101.5 270 top
R30  5K  [S64W]  187.5,98.5 90 top
R30A  2K49  [R0805K]  184.75,99.75 270 top
R31  56K  [R0805K]  192.5,97.5 270 top
R32  3 or 3.01  [R0805K]  191.5,91.75 0 top
R33  39K  [R0805K]  145.5,106.25 90 top
R34  180K  [R0805K]  147.5,106.25 90 top
R35  200K  [R0805K]  137,100.5 90 top
R36  100K  [R0805K]  137,96.5 90 top
R37  10K  [R0805K]  145.5,101.5 270 top
R38  5K  [S64W]  142.5,98.5 90 top
R38A  2K49  [R0805K]  139.75,99.75 270 top
R39  56K  [R0805K]  147.5,97.5 270 top
R40  3 or 3.01  [R0805K]  146.5,91.75 0 top
R41  39K  [R0805K]  100.5,106.25 90 top
R42  180K  [R0805K]  102.5,106.25 90 top
R43  200K  [R0805K]  92,100.5 90 top
R44  100K  [R0805K]  92,96.5 90 top
R45  10K  [R0805K]  100.5,101.5 270 top
R46  5K  [S64W]  97.5,98.5 90 top
R46A  2K49  [R0805K]  94.75,99.75 270 top
R47  56K  [R0805K]  102.5,97.5 270 top
R48  3 or 3.01  [R0805K]  101.5,91.75 0 top
R49  39K  [R0805K]  55.5,106.25 90 top
R50  180K  [R0805K]  57.5,106.25 90 top
R51  200K  [R0805K]  47,100.5 90 top
R52  100K  [R0805K]  47,96.5 90 top
R53  10K  [R0805K]  55.5,101.5 270 top
R54  5K  [S64W]  52.5,98.5 90 top
R54A  2K49  [R0805K]  49.75,99.75 270 top
R55  56K  [R0805K]  57.5,97.5 270 top
R56  3 or 3.01  [R0805K]  56.5,91.75 0 top
R57  39K  [R0805K]  10.5,106.25 90 top
R58  180K  [R0805K]  12.5,106.25 90 top
R59  200K  [R0805K]  2,100.5 90 top
R60  100K  [R0805K]  2,96.5 90 top
R61  10K  [R0805K]  10.5,101.5 270 top
R62  5K  [S64W]  7.5,98.5 90 top
R62A  2K49  [R0805K]  4.75,99.75 270 top
R63  56K  [R0805K]  12.5,97.5 270 top
R64  3 or 3.01  [R0805K]  11.5,91.75 0 top
R65  7K5  [R0805K]  379,63.5 270 top
R66  7K5  [R0805K]  377,63.5 90 top
R67  7K5  [R0805K]  370,63.5 90 top
R68  2K4  [R0805K]  373,63.5 270 top
R69  4K7  [R0805K]  366.5,44 0 top
R70  4K7  [R0805K]  335.5,8.5 270 top
S1  219-05  [CTS-219-05]  360,7 180 top
X1  MINI-FIT-JR-065.5MM  [PCIE6_4.2]  367,100 90 top
X2  MINI-FIT-JR-065.5MM  [PCIE6_4.2]  367,85 90 top
X3  22-23-2031  [22-23-2031]  395,68 270 top
X4  XH2.54-3P  [XH2.54-3P]  395,15 0 top
X5  XH2.54-3P  [XH2.54-3P]  385,15 0 top
X6  AVR-ISP-6VERT  [AVR-ISP-6]  368,40 180 top

## Tracks (layer width: path | path; a pad name or v marks a point on that pad's centre or on a via)
0.9V  (via drill 0.3)
  Top 0.254: v342,26.25 v319.5,26.25 v297,26.25 v274.5,26.25 v252,26.25 v229.5,26.25 v207,26.25 v184.5,26.25 v162,26.25 v139.5,26.25 v117,26.25 v94.5,26.25 v72,26.25 v49.5,26.25 v27,26.25 v4.5,26.25 | IC37.8 6.5,71.5 6.25,71.25 6.25,71 | 6.25,71 6.25,70.5 | 6.25,70.5 IC37.10 | IC39.10 6.25,48 | IC39.8 6.5,49 6.25,48.75 6.25,48.5 | 6.25,48.5 6.25,48 | IC38.8 29,71.5 28.75,71.25 28.75,71 | 28.75,71 28.75,70.5 | 28.75,70.5 IC38.10 | IC40.10 28.75,48 | IC40.8 29,49 28.75,48.75 28.75,48.5 | 28.75,48.5 28.75,48 | IC33.8 51.5,71.5 51.25,71.25 51.25,71 | 51.25,71 51.25,70.5 | 51.25,70.5 IC33.10 | IC35.10 51.25,48 | IC35.8 51.5,49 51.25,48.75 51.25,48.5 | 51.25,48.5 51.25,48 | IC34.8 74,71.5 73.75,71.25 73.75,71 | 73.75,71 73.75,70.5 | 73.75,70.5 IC34.10 | IC36.10 73.75,48 | IC36.8 74,49 73.75,48.75 73.75,48.5 | 73.75,48.5 73.75,48 | IC29.8 96.5,71.5 96.25,71.25 96.25,71 | 96.25,71 96.25,70.5 | 96.25,70.5 IC29.10 | IC31.10 96.25,48 | IC31.8 96.5,49 96.25,48.75 96.25,48.5 | 96.25,48.5 96.25,48 | IC30.8 119,71.5 118.75,71.25 118.75,71 | 118.75,71 118.75,70.5 | 118.75,70.5 IC30.10 | IC32.10 118.75,48 | IC32.8 119,49 118.75,48.75 118.75,48.5 | 118.75,48.5 118.75,48 | IC25.8 141.5,71.5 141.25,71.25 141.25,71 | 141.25,71 141.25,70.5 | 141.25,70.5 IC25.10 | IC27.10 141.25,48 | IC27.8 141.5,49 141.25,48.75 141.25,48.5 | 141.25,48.5 141.25,48 | IC26.8 164,71.5 163.75,71.25 163.75,71 | 163.75,71 163.75,70.5 | 163.75,70.5 IC26.10 | IC28.10 163.75,48 | IC28.8 164,49 163.75,48.75 163.75,48.5 | 163.75,48.5 163.75,48 | IC21.8 186.5,71.5 186.25,71.25 186.25,71 | 186.25,71 186.25,70.5 | 186.25,70.5 IC21.10 | IC23.10 186.25,48 | IC23.8 186.5,49 186.25,48.75 186.25,48.5 | 186.25,48.5 186.25,48
  Top 0.254: IC22.8 209,71.5 208.75,71.25 208.75,71 | 208.75,71 208.75,70.5 | 208.75,70.5 IC22.10 | IC24.10 208.75,48 | IC24.8 209,49 208.75,48.75 208.75,48.5 | 208.75,48.5 208.75,48 | IC17.8 231.5,71.5 231.25,71.25 231.25,71 | 231.25,71 231.25,70.5 | 231.25,70.5 IC17.10 | IC19.10 231.25,48 | IC19.8 231.5,49 231.25,48.75 231.25,48.5 | 231.25,48.5 231.25,48 | IC18.8 254,71.5 253.75,71.25 253.75,71 | 253.75,71 253.75,70.5 | 253.75,70.5 IC18.10 | IC20.10 253.75,48 | IC20.8 254,49 253.75,48.75 253.75,48.5 | 253.75,48.5 253.75,48 | IC13.8 276.5,71.5 276.25,71.25 276.25,71 | 276.25,71 276.25,70.5 | 276.25,70.5 IC13.10 | IC15.10 276.25,48 | IC15.8 276.5,49 276.25,48.75 276.25,48.5 | 276.25,48.5 276.25,48 | IC14.8 299,71.5 298.75,71.25 298.75,71 | 298.75,71 298.75,70.5 | 298.75,70.5 IC14.10 | IC16.10 298.75,48 | IC16.8 299,49 298.75,48.75 298.75,48.5 | 298.75,48.5 298.75,48 | IC9.8 321.5,71.5 321.25,71.25 321.25,71 | 321.25,71 321.25,70.5 | 321.25,70.5 IC9.10 | IC11.10 321.25,48 | 321.25,48 321.25,47.75 321,47.5 v319.5,47.5 | IC11.8 321.5,49 321.25,48.75 321.25,48.5 | 321.25,48.5 321.25,48 | IC10.8 344,71.5 343.75,71.25 343.75,71 | 343.75,71 343.75,70.5 | 343.75,70.5 IC10.10 | IC12.10 343.75,48 | 343.75,48 343.75,47.75 343.5,47.5 v342,47.5 | IC12.8 344,49 343.75,48.75 343.75,48.5 | 343.75,48.5 343.75,48 | v342,70 343.5,70 343.75,70.25 343.75,70.5 | C137.1 343.75,71 | v319.5,70 321,70 321.25,70.25 321.25,70.5 | C130.1 321.25,71 | C144.1 321.25,48.5 | C151.1 343.75,48.5 | C165.1 298.75,71 | v297,70 298.5,70 298.75,70.25 298.75,70.5 | C158.1 276.25,71 | v274.5,70 276,70 276.25,70.25 276.25,70.5 | C179.1 298.75,48.5 | v297,47.5 298.5,47.5 298.75,47.75 298.75,48 | C172.1 276.25,48.5
  Top 0.254: v274.5,47.5 276,47.5 276.25,47.75 276.25,48 | C207.1 253.75,48.5 | v252,47.5 253.5,47.5 253.75,47.75 253.75,48 | C200.1 231.25,48.5 | v229.5,47.5 231,47.5 231.25,47.75 231.25,48 | C193.1 253.75,71 | v252,70 253.5,70 253.75,70.25 253.75,70.5 | C186.1 231.25,71 | v229.5,70 231,70 231.25,70.25 231.25,70.5 | C235.1 208.75,48.5 | v207,47.5 208.5,47.5 208.75,47.75 208.75,48 | C228.1 186.25,48.5 | v184.5,47.5 186,47.5 186.25,47.75 186.25,48 | C221.1 208.75,71 | v207,70 208.5,70 208.75,70.25 208.75,70.5 | C214.1 186.25,71 | v184.5,70 186,70 186.25,70.25 186.25,70.5 | C242.1 141.25,71 | v139.5,70 141,70 141.25,70.25 141.25,70.5 | C249.1 163.75,71 | v162,70 163.5,70 163.75,70.25 163.75,70.5 | C263.1 163.75,48.5 | v162,47.5 163.5,47.5 163.75,47.75 163.75,48 | C256.1 141.25,48.5 | v139.5,47.5 141,47.5 141.25,47.75 141.25,48 | C291.1 118.75,48.5 | v117,47.5 118.5,47.5 118.75,47.75 118.75,48 | C284.1 96.25,48.5 | v94.5,47.5 96,47.5 96.25,47.75 96.25,48 | C277.1 118.75,71 | v117,70 118.5,70 118.75,70.25 118.75,70.5 | C270.1 96.25,71 | v94.5,70 96,70 96.25,70.25 96.25,70.5 | C305.1 73.75,71 | v72,70 73.5,70 73.75,70.25 73.75,70.5 | C298.1 51.25,71 | v49.5,70 51,70 51.25,70.25 51.25,70.5 | C312.1 51.25,48.5 | v49.5,47.5 51,47.5 51.25,47.75 51.25,48 | C319.1 73.75,48.5 | v72,47.5 73.5,47.5 73.75,47.75 73.75,48 | C347.1 28.75,48.5 | v27,47.5 28.5,47.5 28.75,47.75 28.75,48 | C333.1 28.75,71 | v27,70 28.5,70 28.75,70.25 28.75,70.5 | C326.1 6.25,71 | v4.5,70 6,70 6.25,70.25 6.25,70.5 | C340.1 6.25,48.5 | v4.5,47.5 6,47.5 6.25,47.75 6.25,48
  Top 0.406: IC42.5 159.05,18.95 C358.2 | 159.23,19.23 C358.2 | C358.2 v159,21.25 v159,21.75
  Route15 0.254: v4.5,70 v4.5,47.5 v4.5,26.25 | v27,70 v27,47.5 v27,26.25 | v49.5,70 v49.5,47.5 v49.5,26.25 | v72,70 v72,47.5 v72,26.25 | v94.5,70 v94.5,47.5 v94.5,26.25 | v117,70 v117,47.5 v117,26.25 | v139.5,70 v139.5,47.5 v139.5,26.25 | v162,70 v162,47.5 v162,26.25 162,22 161.75,21.75 v159,21.75 v159,21.25 | v184.5,70 v184.5,47.5 v184.5,26.25 | v207,70 v207,47.5 v207,26.25 | v229.5,70 v229.5,47.5 v229.5,26.25 | v252,70 v252,47.5 v252,26.25 | v274.5,70 v274.5,47.5 v274.5,26.25 | v297,70 v297,47.5 v297,26.25 | v319.5,70 v319.5,47.5 v319.5,26.25 | v342,70 v342,47.5 v342,26.25
1.8V  (via drill 0.3)
  Top 0.254: IC37.6 v6,72.5 C325.2 | IC37.5 v6.5,73 6.25,73.25 6.25,73.75 6,74 C327.1 | IC37.56 v12,76.75 | IC37.25 v12,65.75 | IC37.37 v17.25,69.5 | IC39.37 v17.25,47 | IC39.25 v12,43.25 | IC39.56 v12,54.25 | IC39.5 v6.5,50.5 6.25,50.75 6.25,51.25 6,51.5 C341.1 | IC39.6 v6,50 C339.2 | IC38.6 v28.5,72.5 C332.2 | IC38.5 v29,73 28.75,73.25 28.75,73.75 28.5,74 C334.1 | IC38.56 v34.5,76.75 | IC38.25 v34.5,65.75 | IC38.37 v39.75,69.5 | IC40.37 v39.75,47 | IC40.25 v34.5,43.25 | IC40.56 v34.5,54.25 | IC40.5 v29,50.5 28.75,50.75 28.75,51.25 28.5,51.5 C348.1 | IC40.6 v28.5,50 C346.2 | v6,27.25 v28.5,27.25 v51,27.25 v73.5,27.25 v96,27.25 v118.5,27.25 v141,27.25 v163.5,27.25 v186,27.25 v208.5,27.25 v231,27.25 v253.5,27.25 v276,27.25 v298.5,27.25 v321,27.25 v343.5,27.25 | IC33.6 v51,72.5 C297.2 | IC33.5 v51.5,73 51.25,73.25 51.25,73.75 51,74 C299.1 | IC33.56 v57,76.75 | IC33.25 v57,65.75 | IC33.37 v62.25,69.5 | IC35.37 v62.25,47 | IC35.25 v57,43.25 | IC35.56 v57,54.25 | IC35.5 v51.5,50.5 51.25,50.75 51.25,51.25 51,51.5 C313.1 | IC35.6 v51,50 C311.2 | IC34.6 v73.5,72.5 C304.2 | IC34.5 v74,73 73.75,73.25 73.75,73.75 73.5,74 C306.1 | IC34.56 v79.5,76.75 | IC34.25 v79.5,65.75 | IC34.37 v84.75,69.5 | IC36.37 v84.75,47 | IC36.25 v79.5,43.25 | IC36.56 v79.5,54.25 | IC36.5 v74,50.5 73.75,50.75 73.75,51.25 73.5,51.5 C320.1 | IC36.6 v73.5,50 C318.2 | IC29.6 v96,72.5 C269.2 | IC29.5 v96.5,73 96.25,73.25 96.25,73.75 96,74 C271.1 | IC29.56 v102,76.75 | IC29.25 v102,65.75 | IC29.37 v107.25,69.5 | IC31.37 v107.25,47 | IC31.25 v102,43.25 | IC31.56 v102,54.25 | IC31.5 v96.5,50.5 96.25,50.75 96.25,51.25 96,51.5 C285.1 | IC31.6 v96,50 C283.2 | IC30.6 v118.5,72.5 C276.2 | IC30.5 v119,73 118.75,73.25 118.75,73.75 118.5,74 C278.1
  Top 0.254: IC30.56 v124.5,76.75 | IC30.25 v124.5,65.75 | IC30.37 v129.75,69.5 | IC32.37 v129.75,47 | IC32.25 v124.5,43.25 | IC32.56 v124.5,54.25 | IC32.5 v119,50.5 118.75,50.75 118.75,51.25 118.5,51.5 C292.1 | IC32.6 v118.5,50 C290.2 | IC25.6 v141,72.5 C241.2 | IC25.5 v141.5,73 141.25,73.25 141.25,73.75 141,74 C243.1 | IC25.56 v147,76.75 | IC25.25 v147,65.75 | IC25.37 v152.25,69.5 | IC27.37 v152.25,47 | IC27.25 v147,43.25 | IC27.56 v147,54.25 | IC27.5 v141.5,50.5 141.25,50.75 141.25,51.25 141,51.5 C257.1 | IC27.6 v141,50 C255.2 | IC26.6 v163.5,72.5 C248.2 | IC26.5 v164,73 163.75,73.25 163.75,73.75 163.5,74 C250.1 | IC26.56 v169.5,76.75 | IC26.25 v169.5,65.75 | IC26.37 v174.75,69.5 | IC28.37 v174.75,47 | IC28.25 v169.5,43.25 | IC28.56 v169.5,54.25 | IC28.5 v164,50.5 163.75,50.75 163.75,51.25 163.5,51.5 C264.1 | IC28.6 v163.5,50 C262.2 | IC21.6 v186,72.5 C213.2 | IC21.5 v186.5,73 186.25,73.25 186.25,73.75 186,74 C215.1 | IC21.56 v192,76.75 | IC21.25 v192,65.75 | IC21.37 v197.25,69.5 | IC23.37 v197.25,47 | IC23.25 v192,43.25 | IC23.56 v192,54.25 | IC23.5 v186.5,50.5 186.25,50.75 186.25,51.25 186,51.5 C229.1 | IC23.6 v186,50 C227.2 | IC22.6 v208.5,72.5 C220.2 | IC22.5 v209,73 208.75,73.25 208.75,73.75 208.5,74 C222.1 | IC22.56 v214.5,76.75 | IC22.25 v214.5,65.75 | IC22.37 v219.75,69.5 | IC24.37 v219.75,47 | IC24.25 v214.5,43.25 | IC24.56 v214.5,54.25 | IC24.5 v209,50.5 208.75,50.75 208.75,51.25 208.5,51.5 C236.1 | IC24.6 v208.5,50 C234.2 | IC17.6 v231,72.5 C185.2 | IC17.5 v231.5,73 231.25,73.25 231.25,73.75 231,74 C187.1 | IC17.56 v237,76.75 | IC17.25 v237,65.75 | IC17.37 v242.25,69.5 | IC19.37 v242.25,47 | IC19.25 v237,43.25 | IC19.56 v237,54.25 | IC19.5 v231.5,50.5 231.25,50.75 231.25,51.25 231,51.5 C201.1
  Top 0.254: IC19.6 v231,50 C199.2 | IC18.6 v253.5,72.5 C192.2 | IC18.5 v254,73 253.75,73.25 253.75,73.75 253.5,74 C194.1 | IC18.56 v259.5,76.75 | IC18.25 v259.5,65.75 | IC18.37 v264.75,69.5 | IC20.37 v264.75,47 | IC20.25 v259.5,43.25 | IC20.56 v259.5,54.25 | IC20.5 v254,50.5 253.75,50.75 253.75,51.25 253.5,51.5 C208.1 | IC20.6 v253.5,50 C206.2 | IC13.6 v276,72.5 C157.2 | IC13.5 v276.5,73 276.25,73.25 276.25,73.75 276,74 C159.1 | IC13.56 v282,76.75 | IC13.25 v282,65.75 | IC13.37 v287.25,69.5 | IC15.37 v287.25,47 | IC15.25 v282,43.25 | IC15.56 v282,54.25 | IC15.5 v276.5,50.5 276.25,50.75 276.25,51.25 276,51.5 C173.1 | IC15.6 v276,50 C171.2 | IC14.6 v298.5,72.5 C164.2 | IC14.5 v299,73 298.75,73.25 298.75,73.75 298.5,74 C166.1 | IC14.56 v304.5,76.75 | IC14.25 v304.5,65.75 | IC14.37 v309.75,69.5 | IC16.37 v309.75,47 | IC16.25 v304.5,43.25 | IC16.56 v304.5,54.25 | IC16.5 v299,50.5 298.75,50.75 298.75,51.25 298.5,51.5 C180.1 | IC16.6 v298.5,50 C178.2 | IC9.6 v321,72.5 C129.2 | IC9.5 v321.5,73 321.25,73.25 321.25,73.75 321,74 C131.1 | IC9.56 v327,76.75 | IC9.25 v327,65.75 | IC9.37 v332.25,69.5 | IC11.37 v332.25,47 | IC11.25 v327,43.25 | IC11.56 v327,54.25 | IC11.6 v321,50 C143.2 | IC10.6 v343.5,72.5 C136.2 | IC10.5 v344,73 343.75,73.25 343.75,73.75 343.5,74 C138.1 | IC10.56 v349.5,76.75 | IC10.25 v349.5,65.75 | IC10.37 v354.75,69.5 | IC12.37 v354.75,47 | IC12.25 v349.5,43.25 | IC12.56 v349.5,54.25 | IC12.5 v344,50.5 343.75,50.75 343.75,51.25 343.5,51.5 C152.1 | IC12.6 v343.5,50 C150.2 | IC11.5 v321.5,50.5 321.25,50.75 321.25,51.25 321,51.5 C145.1
  Top 0.406: IC43.5 165.05,18.95 C360.2 | 165.23,19.23 C360.2 | C360.2 v165,21.25 v165,21.75
  Route15 0.254: 12,67.25 8,67.25 7.75,67.5 7.75,72.25 7.5,72.5 v6,72.5 v6,50 | 12,67.25 15.5,67.25 15.75,67.5 15.75,69.5 | 15.75,69.5 15.75,75 15.5,75.25 12,75.25 | 12,75.25 8,75.25 7.75,75 7.75,73.25 7.5,73 v6.5,73 | v12,76.75 12,75.25 | v12,65.75 12,67.25 | v17.25,69.5 15.75,69.5 | v17.25,47 15.75,47 | 15.75,47 15.75,45 15.5,44.75 12,44.75 | 12,44.75 8,44.75 7.75,45 7.75,49.75 7.5,50 v6,50 | v12,43.25 12,44.75 | 15.75,47 15.75,52.5 15.5,52.75 12,52.75 | 12,52.75 8,52.75 7.75,52.5 7.75,50.75 7.5,50.5 v6.5,50.5 | v12,54.25 12,52.75 | 34.5,67.25 30.5,67.25 30.25,67.5 30.25,72.25 30,72.5 v28.5,72.5 v28.5,50 | 34.5,67.25 38,67.25 38.25,67.5 38.25,69.5 | 38.25,69.5 38.25,75 38,75.25 34.5,75.25 | 34.5,75.25 30.5,75.25 30.25,75 30.25,73.25 30,73 v29,73 | v34.5,76.75 34.5,75.25 | v34.5,65.75 34.5,67.25 | v39.75,69.5 38.25,69.5 | v39.75,47 38.25,47 | 38.25,47 38.25,45 38,44.75 34.5,44.75 | 34.5,44.75 30.5,44.75 30.25,45 30.25,49.75 30,50 v28.5,50 | v34.5,43.25 34.5,44.75 | 38.25,47 38.25,52.5 38,52.75 34.5,52.75 | 34.5,52.75 30.5,52.75 30.25,52.5 30.25,50.75 30,50.5 v29,50.5 | v34.5,54.25 34.5,52.75 | v6,50 v6,27.25 | v28.5,50 v28.5,27.25 | 57,67.25 53,67.25 52.75,67.5 52.75,72.25 52.5,72.5 v51,72.5 v51,50 | 57,67.25 60.5,67.25 60.75,67.5 60.75,69.5 | 60.75,69.5 60.75,75 60.5,75.25 57,75.25 | 57,75.25 53,75.25 52.75,75 52.75,73.25 52.5,73 v51.5,73 | v57,76.75 57,75.25 | v57,65.75 57,67.25 | v62.25,69.5 60.75,69.5 | v62.25,47 60.75,47 | 60.75,47 60.75,45 60.5,44.75 57,44.75 | 57,44.75 53,44.75 52.75,45 52.75,49.75 52.5,50 v51,50 | v57,43.25 57,44.75 | 60.75,47 60.75,52.5 60.5,52.75 57,52.75 | 57,52.75 53,52.75 52.75,52.5 52.75,50.75 52.5,50.5 v51.5,50.5
  Route15 0.254: v57,54.25 57,52.75 | 79.5,67.25 75.5,67.25 75.25,67.5 75.25,72.25 75,72.5 v73.5,72.5 v73.5,50 | 79.5,67.25 83,67.25 83.25,67.5 83.25,69.5 | 83.25,69.5 83.25,75 83,75.25 79.5,75.25 | 79.5,75.25 75.5,75.25 75.25,75 75.25,73.25 75,73 v74,73 | v79.5,76.75 79.5,75.25 | v79.5,65.75 79.5,67.25 | v84.75,69.5 83.25,69.5 | v84.75,47 83.25,47 | 83.25,47 83.25,45 83,44.75 79.5,44.75 | 79.5,44.75 75.5,44.75 75.25,45 75.25,49.75 75,50 v73.5,50 | v79.5,43.25 79.5,44.75 | 83.25,47 83.25,52.5 83,52.75 79.5,52.75 | 79.5,52.75 75.5,52.75 75.25,52.5 75.25,50.75 75,50.5 v74,50.5 | v79.5,54.25 79.5,52.75 | v51,50 v51,27.25 | v73.5,50 v73.5,27.25 | 102,67.25 98,67.25 97.75,67.5 97.75,72.25 97.5,72.5 v96,72.5 v96,50 | 102,67.25 105.5,67.25 105.75,67.5 105.75,69.5 | 105.75,69.5 105.75,75 105.5,75.25 102,75.25 | 102,75.25 98,75.25 97.75,75 97.75,73.25 97.5,73 v96.5,73 | v102,76.75 102,75.25 | v102,65.75 102,67.25 | v107.25,69.5 105.75,69.5 | v107.25,47 105.75,47 | 105.75,47 105.75,45 105.5,44.75 102,44.75 | 102,44.75 98,44.75 97.75,45 97.75,49.75 97.5,50 v96,50 | v102,43.25 102,44.75 | 105.75,47 105.75,52.5 105.5,52.75 102,52.75 | 102,52.75 98,52.75 97.75,52.5 97.75,50.75 97.5,50.5 v96.5,50.5 | v102,54.25 102,52.75 | 124.5,67.25 120.5,67.25 120.25,67.5 120.25,72.25 120,72.5 v118.5,72.5 v118.5,50 | 124.5,67.25 128,67.25 128.25,67.5 128.25,69.5 | 128.25,69.5 128.25,75 128,75.25 124.5,75.25 | 124.5,75.25 120.5,75.25 120.25,75 120.25,73.25 120,73 v119,73 | v124.5,76.75 124.5,75.25 | v124.5,65.75 124.5,67.25 | v129.75,69.5 128.25,69.5 | v129.75,47 128.25,47 | 128.25,47 128.25,45 128,44.75 124.5,44.75 | 124.5,44.75 120.5,44.75 120.25,45 120.25,49.75 120,50 v118.5,50
  Route15 0.254: v124.5,43.25 124.5,44.75 | 128.25,47 128.25,52.5 128,52.75 124.5,52.75 | 124.5,52.75 120.5,52.75 120.25,52.5 120.25,50.75 120,50.5 v119,50.5 | v124.5,54.25 124.5,52.75 | v96,50 v96,27.25 | v118.5,50 v118.5,27.25 | 147,67.25 143,67.25 142.75,67.5 142.75,72.25 142.5,72.5 v141,72.5 v141,50 | 147,67.25 150.5,67.25 150.75,67.5 150.75,69.5 | 150.75,69.5 150.75,75 150.5,75.25 147,75.25 | 147,75.25 143,75.25 142.75,75 142.75,73.25 142.5,73 v141.5,73 | v147,76.75 147,75.25 | v147,65.75 147,67.25 | v152.25,69.5 150.75,69.5 | v152.25,47 150.75,47 | 150.75,47 150.75,45 150.5,44.75 147,44.75 | 147,44.75 143,44.75 142.75,45 142.75,49.75 142.5,50 v141,50 | v147,43.25 147,44.75 | 150.75,47 150.75,52.5 150.5,52.75 147,52.75 | 147,52.75 143,52.75 142.75,52.5 142.75,50.75 142.5,50.5 v141.5,50.5 | v147,54.25 147,52.75 | 169.5,67.25 165.5,67.25 165.25,67.5 165.25,72.25 165,72.5 v163.5,72.5 v163.5,50 | 169.5,67.25 173,67.25 173.25,67.5 173.25,69.5 | 173.25,69.5 173.25,75 173,75.25 169.5,75.25 | 169.5,75.25 165.5,75.25 165.25,75 165.25,73.25 165,73 v164,73 | v169.5,76.75 169.5,75.25 | v169.5,65.75 169.5,67.25 | v174.75,69.5 173.25,69.5 | v174.75,47 173.25,47 | 173.25,47 173.25,45 173,44.75 169.5,44.75 | 169.5,44.75 165.5,44.75 165.25,45 165.25,49.75 165,50 v163.5,50 | v169.5,43.25 169.5,44.75 | 173.25,47 173.25,52.5 173,52.75 169.5,52.75 | 169.5,52.75 165.5,52.75 165.25,52.5 165.25,50.75 165,50.5 v164,50.5 | v169.5,54.25 169.5,52.75 | v141,50 v141,27.25 | v163.5,50 v163.5,27.25 163.5,22 163.75,21.75 v165,21.75 v165,21.25 | 192,67.25 188,67.25 187.75,67.5 187.75,72.25 187.5,72.5 v186,72.5 v186,50 | 192,67.25 195.5,67.25 195.75,67.5 195.75,69.5
  Route15 0.254: 195.75,69.5 195.75,75 195.5,75.25 192,75.25 | 192,75.25 188,75.25 187.75,75 187.75,73.25 187.5,73 v186.5,73 | v192,76.75 192,75.25 | v192,65.75 192,67.25 | v197.25,69.5 195.75,69.5 | v197.25,47 195.75,47 | 195.75,47 195.75,45 195.5,44.75 192,44.75 | 192,44.75 188,44.75 187.75,45 187.75,49.75 187.5,50 v186,50 | v192,43.25 192,44.75 | 195.75,47 195.75,52.5 195.5,52.75 192,52.75 | 192,52.75 188,52.75 187.75,52.5 187.75,50.75 187.5,50.5 v186.5,50.5 | v192,54.25 192,52.75 | 214.5,67.25 210.5,67.25 210.25,67.5 210.25,72.25 210,72.5 v208.5,72.5 v208.5,50 | 214.5,67.25 218,67.25 218.25,67.5 218.25,69.5 | 218.25,69.5 218.25,75 218,75.25 214.5,75.25 | 214.5,75.25 210.5,75.25 210.25,75 210.25,73.25 210,73 v209,73 | v214.5,76.75 214.5,75.25 | v214.5,65.75 214.5,67.25 | v219.75,69.5 218.25,69.5 | v219.75,47 218.25,47 | 218.25,47 218.25,45 218,44.75 214.5,44.75 | 214.5,44.75 210.5,44.75 210.25,45 210.25,49.75 210,50 v208.5,50 | v214.5,43.25 214.5,44.75 | 218.25,47 218.25,52.5 218,52.75 214.5,52.75 | 214.5,52.75 210.5,52.75 210.25,52.5 210.25,50.75 210,50.5 v209,50.5 | v214.5,54.25 214.5,52.75 | v186,50 v186,27.25 | v208.5,50 v208.5,27.25 | 237,67.25 233,67.25 232.75,67.5 232.75,72.25 232.5,72.5 v231,72.5 v231,50 | 237,67.25 240.5,67.25 240.75,67.5 240.75,69.5 | 240.75,69.5 240.75,75 240.5,75.25 237,75.25 | 237,75.25 233,75.25 232.75,75 232.75,73.25 232.5,73 v231.5,73 | v237,76.75 237,75.25 | v237,65.75 237,67.25 | v242.25,69.5 240.75,69.5 | v242.25,47 240.75,47 | 240.75,47 240.75,45 240.5,44.75 237,44.75 | 237,44.75 233,44.75 232.75,45 232.75,49.75 232.5,50 v231,50 | v237,43.25 237,44.75 | 240.75,47 240.75,52.5 240.5,52.75 237,52.75
  Route15 0.254: 237,52.75 233,52.75 232.75,52.5 232.75,50.75 232.5,50.5 v231.5,50.5 | v237,54.25 237,52.75 | 259.5,67.25 255.5,67.25 255.25,67.5 255.25,72.25 255,72.5 v253.5,72.5 v253.5,50 | 259.5,67.25 263,67.25 263.25,67.5 263.25,69.5 | 263.25,69.5 263.25,75 263,75.25 259.5,75.25 | 259.5,75.25 255.5,75.25 255.25,75 255.25,73.25 255,73 v254,73 | v259.5,76.75 259.5,75.25 | v259.5,65.75 259.5,67.25 | v264.75,69.5 263.25,69.5 | v264.75,47 263.25,47 | 263.25,47 263.25,45 263,44.75 259.5,44.75 | 259.5,44.75 255.5,44.75 255.25,45 255.25,49.75 255,50 v253.5,50 | v259.5,43.25 259.5,44.75 | 263.25,47 263.25,52.5 263,52.75 259.5,52.75 | 259.5,52.75 255.5,52.75 255.25,52.5 255.25,50.75 255,50.5 v254,50.5 | v259.5,54.25 259.5,52.75 | v231,50 v231,27.25 | v253.5,50 v253.5,27.25 | 282,67.25 278,67.25 277.75,67.5 277.75,72.25 277.5,72.5 v276,72.5 v276,50 | 282,67.25 285.5,67.25 285.75,67.5 285.75,69.5 | 285.75,69.5 285.75,75 285.5,75.25 282,75.25 | 282,75.25 278,75.25 277.75,75 277.75,73.25 277.5,73 v276.5,73 | v282,76.75 282,75.25 | v282,65.75 282,67.25 | v287.25,69.5 285.75,69.5 | v287.25,47 285.75,47 | 285.75,47 285.75,45 285.5,44.75 282,44.75 | 282,44.75 278,44.75 277.75,45 277.75,49.75 277.5,50 v276,50 | v282,43.25 282,44.75 | 285.75,47 285.75,52.5 285.5,52.75 282,52.75 | 282,52.75 278,52.75 277.75,52.5 277.75,50.75 277.5,50.5 v276.5,50.5 | v282,54.25 282,52.75 | 304.5,67.25 300.5,67.25 300.25,67.5 300.25,72.25 300,72.5 v298.5,72.5 v298.5,50 | 304.5,67.25 308,67.25 308.25,67.5 308.25,69.5 | 308.25,69.5 308.25,75 308,75.25 304.5,75.25 | 304.5,75.25 300.5,75.25 300.25,75 300.25,73.25 300,73 v299,73 | v304.5,76.75 304.5,75.25